# EasyEDA Pro project ProPrj_DSP BOARD_2026-03-01.epro, schematic Schematic1
Page Name: P1; Project Name: Project Name; Schematic Name: Schematic Name; Update Date: 2021.11.05; Company: EasyEDA.com; Drawn: SUGEX; Page Size: A4; Version: V1.0
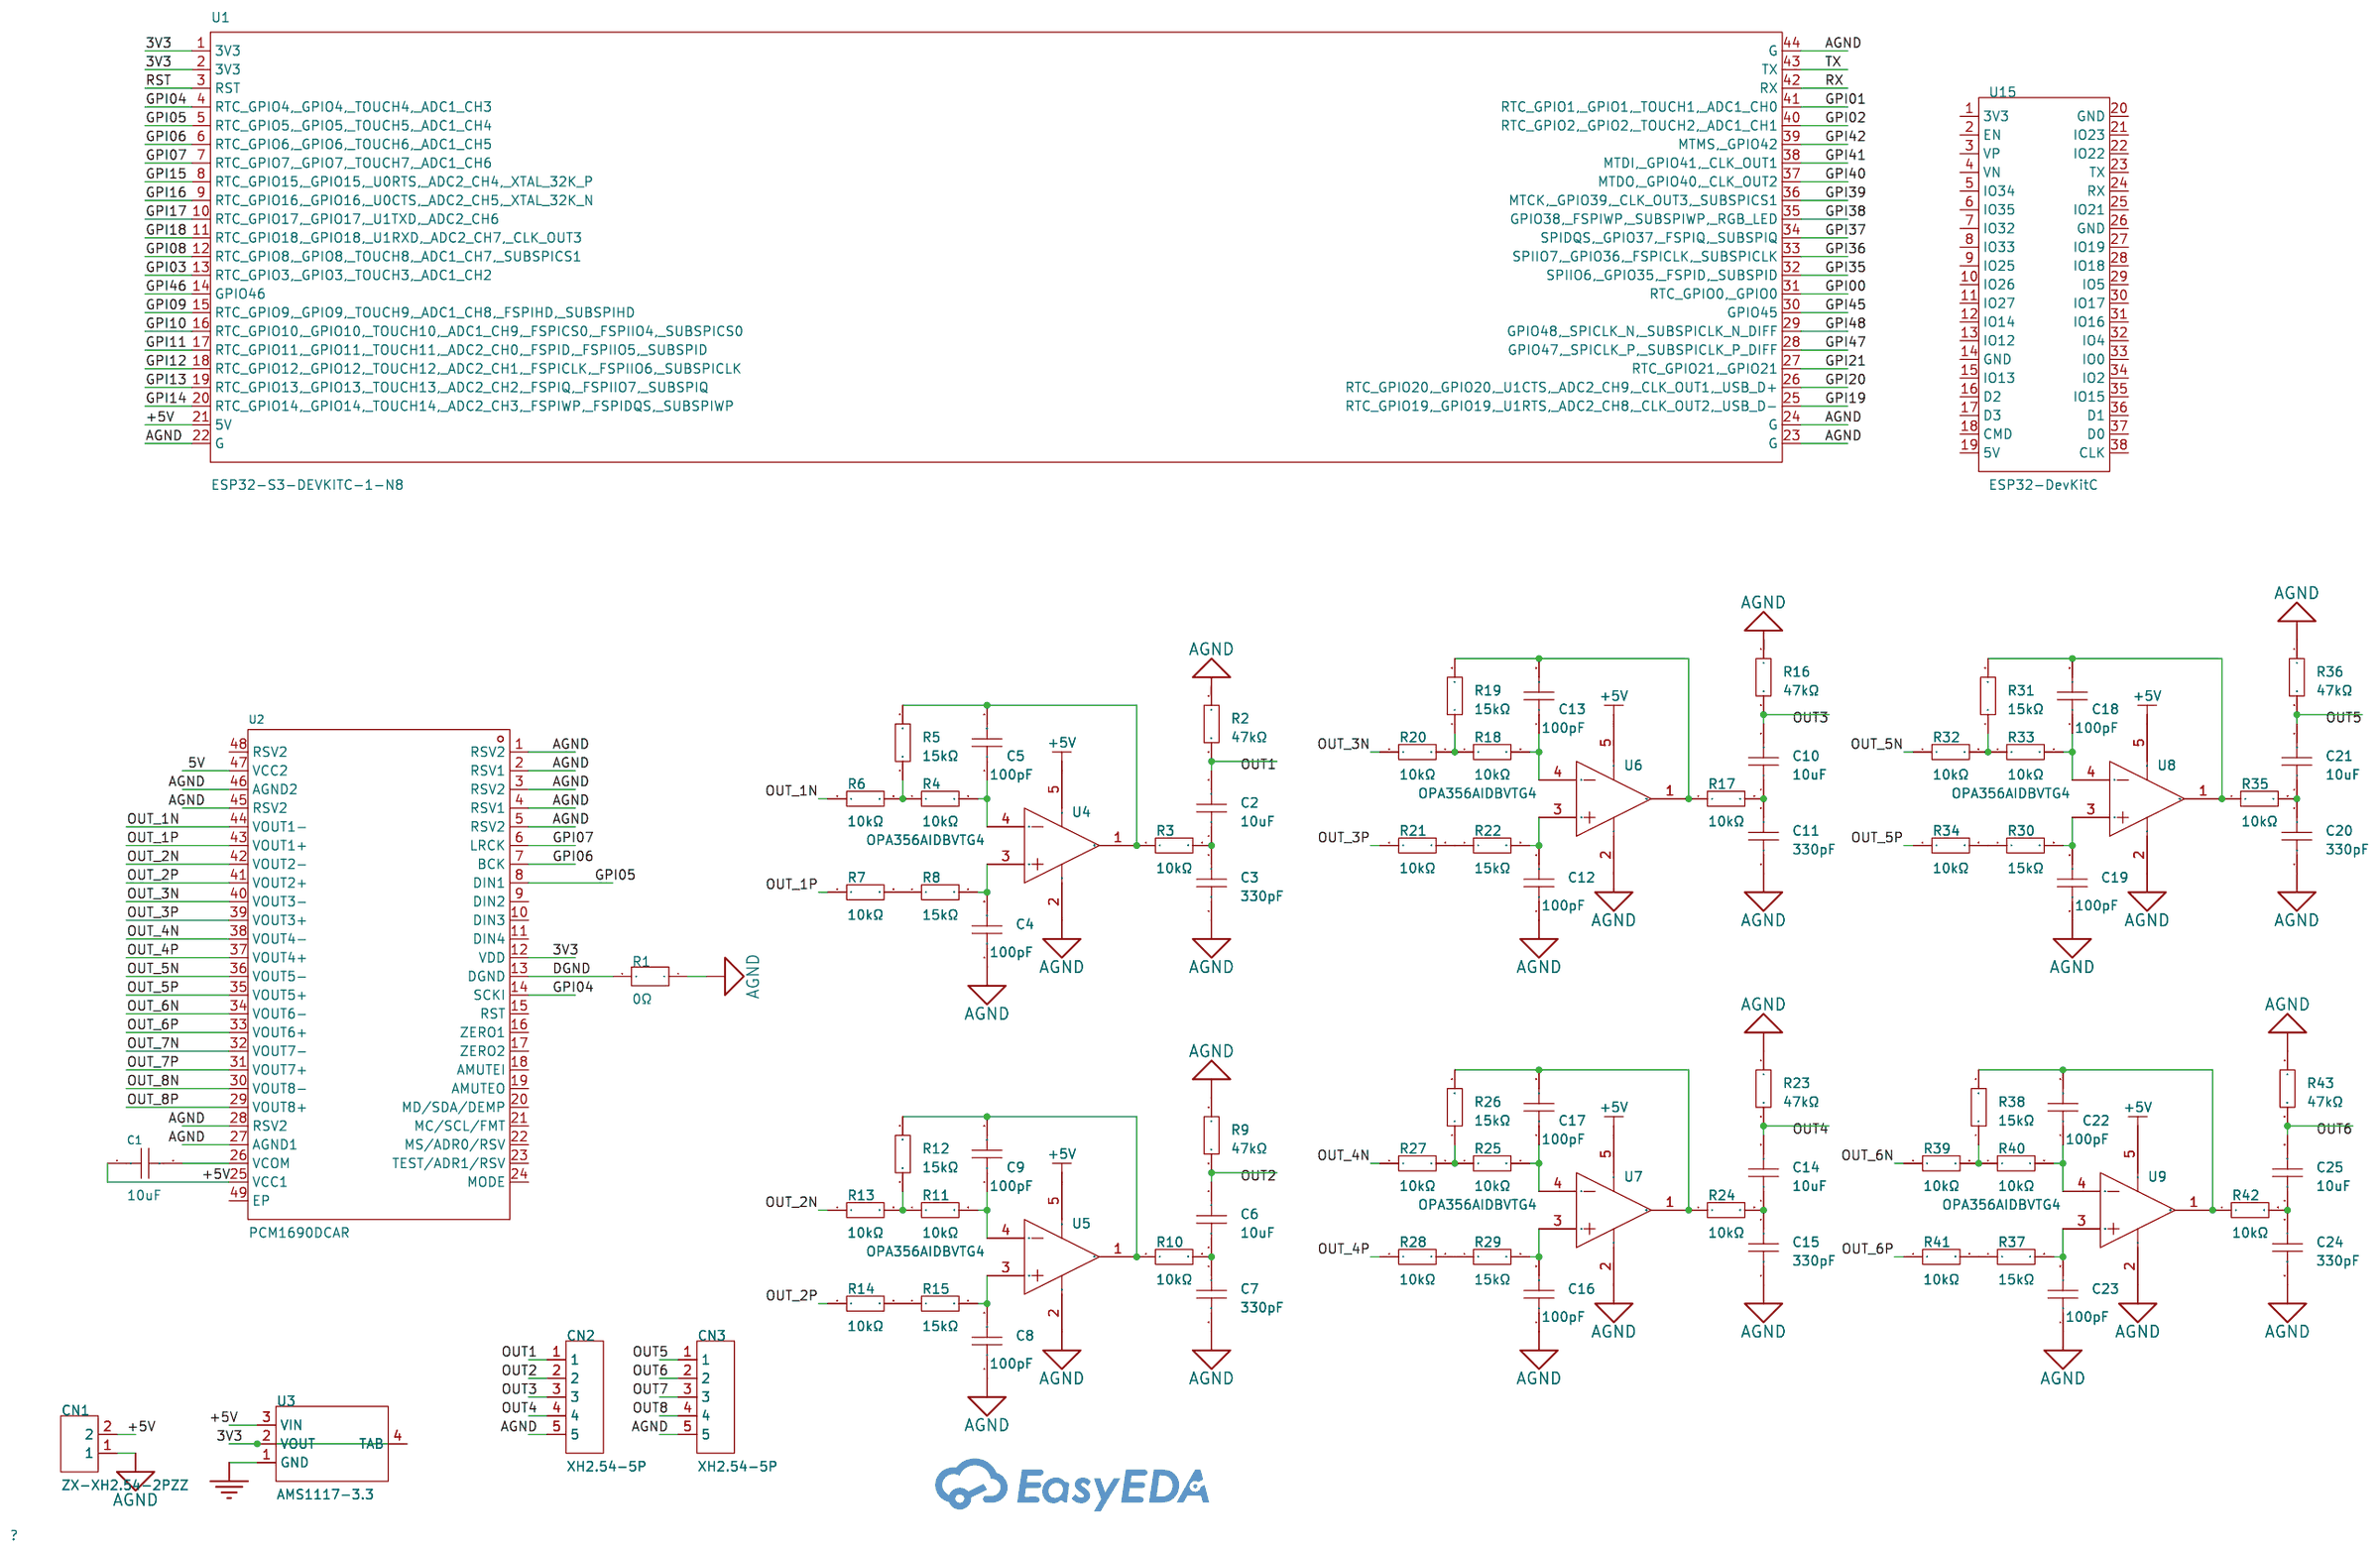
[diagram p0: schematic sheet]

## Parts
C1  10uF  [C0603]
C2  10uF  [C0603]
C3  330pF  [C0603]
C4  100pF  [C0603]
C5  100pF  [C0603]
C6  10uF  [C0603]
C7  330pF  [C0603]
C8  100pF  [C0603]
C9  100pF  [C0603]
C10  10uF  [C0603]
C11  330pF  [C0603]
C12  100pF  [C0603]
C13  100pF  [C0603]
C14  10uF  [C0603]
C15  330pF  [C0603]
C16  100pF  [C0603]
C17  100pF  [C0603]
C18  100pF  [C0603]
C19  100pF  [C0603]
C20  330pF  [C0603]
C21  10uF  [C0603]
C22  100pF  [C0603]
C23  100pF  [C0603]
C24  330pF  [C0603]
C25  10uF  [C0603]
CN1  ZX-XH2.54-2PZZ  [CONN-TH_2P-P2.50_HX25003-2A]  (no BOM)
CN2  XH2.54-5P  [CONN-TH_5P-P2.54_C9900008095]  (no BOM)
CN3  XH2.54-5P  [CONN-TH_5P-P2.54_C9900008095]  (no BOM)
R1  0Ω  [R0402]
R2  47kΩ  [R0603]
R3  10kΩ  [R0603]
R4  10kΩ  [R0603]
R5  15kΩ  [R0603]
R6  10kΩ  [R0603]
R7  10kΩ  [R0603]
R8  15kΩ  [R0603]
R9  47kΩ  [R0603]
R10  10kΩ  [R0603]
R11  10kΩ  [R0603]
R12  15kΩ  [R0603]
R13  10kΩ  [R0603]
R14  10kΩ  [R0603]
R15  15kΩ  [R0603]
R16  47kΩ  [R0603]
R17  10kΩ  [R0603]
R18  10kΩ  [R0603]
R19  15kΩ  [R0603]
R20  10kΩ  [R0603]
R21  10kΩ  [R0603]
R22  15kΩ  [R0603]
R23  47kΩ  [R0603]
R24  10kΩ  [R0603]
R25  10kΩ  [R0603]
R26  15kΩ  [R0603]
R27  10kΩ  [R0603]
R28  10kΩ  [R0603]
R29  15kΩ  [R0603]
R30  15kΩ  [R0603]
R31  15kΩ  [R0603]
R32  10kΩ  [R0603]
R33  10kΩ  [R0603]
R34  10kΩ  [R0603]
R35  10kΩ  [R0603]
R36  47kΩ  [R0603]
R37  15kΩ  [R0603]
R38  15kΩ  [R0603]
R39  10kΩ  [R0603]
R40  10kΩ  [R0603]
R41  10kΩ  [R0603]
R42  10kΩ  [R0603]
R43  47kΩ  [R0603]
U1  ESP32-S3-DEVKITC-1-N8  [CONN-TH_ESP32-S3-DEVKITC-1U-N8]  (no BOM)
U2  PCM1690DCAR  [HTSSOP-48_L12.5-W6.1-P0.50-LS8.1-BL-EP-1]
U3  AMS1117-3.3  [SOT-223-3_L6.5-W3.5-P3.05-LS7.0]
U4  OPA356AIDBVTG4  [SOT-23-5_L3.0-W1.5-P0.95-LS2.8-BL]
U5  OPA356AIDBVTG4  [SOT-23-5_L3.0-W1.5-P0.95-LS2.8-BL]
U6  OPA356AIDBVTG4  [SOT-23-5_L3.0-W1.5-P0.95-LS2.8-BL]
U7  OPA356AIDBVTG4  [SOT-23-5_L3.0-W1.5-P0.95-LS2.8-BL]
U8  OPA356AIDBVTG4  [SOT-23-5_L3.0-W1.5-P0.95-LS2.8-BL]
U9  OPA356AIDBVTG4  [SOT-23-5_L3.0-W1.5-P0.95-LS2.8-BL]
U15  ESP32-DevKitC  [BULETM-SMD_ESP32-DEVKITC]  (no BOM)

## Library data of the parts
C1 = CL10A106MA8NRNC: Capacitance:10uF Tolerance:±20% Tolerance:±20% Voltage Rating:25V Temperature Coefficient:X5R; LCSC Part Name: 10uF ±20% 25V; Supplier Part: C96446; Manufacturer: SAMSUNG(三星); Supplier Footprint: 0603; JLCPCB Part Class: Basic Part; Datasheet: https://item.szlcsc.com/datasheet/CL10A106MA8NRNC/97651.html; Supplier: LCSC; Tolerance: ±20%; Voltage Rating: 25V; Temperature Coefficient: X5R
C2-C25 = CAP_0603: Supplier Footprint: 0603
CN1 = ZX-XH2.54-2PZZ: Pins Structure:1x2P Pitch:2.5mm Mounting Type:Through Hole Reference Series:XH Number of Pins:2P Number of Rows:1 Number of PINs Per Row:2 Row Spacing:- Current Rating:2A Contact Material:Brass Contact Plating:Tin Operating Temperature:-25℃~+85℃ Operating; LCSC Part Name: 1x2P 间距:2.5mm 直插 系列:XH; Supplier Part: C7429632; Manufacturer: Megastar(兆星); Supplier Footprint: 插件,P=2.5mm; JLCPCB Part Class: Extended Part; Datasheet: https://item.szlcsc.com/datasheet/ZX-XH2.54-2PZZ/8427549.html; Supplier: LCSC; Pins Structure: 1x2P; Pitch: 2.5mm; Mounting Type: Through Hole; Reference Series: XH; Number of Pins: 2P; Number of Rows: 1; Number of PINs Per Row: 2; Current Rating: 2A; Contact Material: Brass; Contact Plating: Tin; Operating Temperature: -25℃~+85℃; Voltage Rating: 250V; Plastic Material: PA66; Flame Retardant Rating: UL94V-0; Color: White; Z-Height of the Board: 7mm; X-Length of Bottom Edge on Board (Spacing Line): 7.5mm; Y-Width of Bottom Edge on Board: 5.9mm
CN2 CN3 = XH2.54-5P: Supplier Part: C9900017328; JLCPCB Part Class: Extended Part; Supplier: LCSC
R1 = FRC0402P000 TS: Type:Thick Film Resistor Resistance:0Ω Tolerance:±5% Tolerance:±5% Power(Watts):62.5mW Voltage-Supply(Max):50V Operating Temperature:-55℃~+155℃ Operating Temperature:-55℃~+155℃; LCSC Part Name: 0Ω ±5% 62.5mW 厚膜电阻; Supplier Part: C2906877; Manufacturer: FOJAN(富捷); Supplier Footprint: 0402; JLCPCB Part Class: Extended Part; Supplier: LCSC; Type: Thick Film Resistor; Tolerance: ±5%; Power(Watts): 62.5mW; Voltage-Supply(Max): 50V; Operating Temperature: -55℃~+155℃
R2 R9 R16 R23 R36 R43 = FRC0603F4702TS: Type:Thick Film Resistor Resistance:47kΩ Tolerance:±1% Tolerance:±1% Power(Watts):100mW Voltage-Supply(Max):75V Temperature Coefficient:±100ppm/℃ Temperature Coefficient:±100ppm/℃ Operating Temperature:-55℃~+155℃ Operating Temperature:-55℃~+155℃; LCSC Part Name: 47kΩ ±1% 100mW 厚膜电阻; Supplier Part: C2907042; Manufacturer: FOJAN(富捷); Supplier Footprint: 0603; JLCPCB Part Class: Extended Part; Supplier: LCSC; Type: Thick Film Resistor; Tolerance: ±1%; Power(Watts): 100mW; Voltage-Supply(Max): 75V; Temperature Coefficient: ±100ppm/℃; Operating Temperature: -55℃~+155℃
R3 R4 R6 R7 R10 R11 R13 R14 R17 R18 R20 R21 R24 R25 R27 R28 R32-R35 R39-R42 = FRC0603F1002TS: Type:Thick Film Resistor Resistance:10kΩ Tolerance:±1% Tolerance:±1% Power(Watts):100mW Voltage-Supply(Max):75V Temperature Coefficient:±100ppm/℃ Temperature Coefficient:±100ppm/℃ Operating Temperature:-55℃~+155℃ Operating Temperature:-55℃~+155℃; LCSC Part Name: 10kΩ ±1% 100mW 厚膜电阻; Supplier Part: C2906982; Manufacturer: FOJAN(富捷); Supplier Footprint: 0603; JLCPCB Part Class: Extended Part; Supplier: LCSC; Type: Thick Film Resistor; Tolerance: ±1%; Power(Watts): 100mW; Voltage-Supply(Max): 75V; Temperature Coefficient: ±100ppm/℃; Operating Temperature: -55℃~+155℃
R5 R8 R12 R15 R19 R22 R26 R29-R31 R37 R38 = FRC0603F1502TS: Type:Thick Film Resistor Resistance:15kΩ Tolerance:±1% Tolerance:±1% Power(Watts):100mW Voltage-Supply(Max):75V Temperature Coefficient:±100ppm/℃ Temperature Coefficient:±100ppm/℃ Operating Temperature:-55℃~+155℃ Operating Temperature:-55℃~+155℃; LCSC Part Name: 15kΩ ±1% 100mW 厚膜电阻; Supplier Part: C2906995; Manufacturer: FOJAN(富捷); Supplier Footprint: 0603; JLCPCB Part Class: Extended Part; Supplier: LCSC; Type: Thick Film Resistor; Tolerance: ±1%; Power(Watts): 100mW; Voltage-Supply(Max): 75V; Temperature Coefficient: ±100ppm/℃; Operating Temperature: -55℃~+155℃
U1 = ESP32-S3-DEVKITC-1-N8: Supplier Part: C20438410; Manufacturer: ESPRESSIF(乐鑫); JLCPCB Part Class: Extended Part; Supplier: LCSC
U2 = PCM1690DCAR: Resolution(Bits):24 Number of Channels:8 Interface:I2C Voltage - Supply:4.5V~5.5V Voltage - Supply:4.5V~5.5V Settling Time:- Output Type:- Integral non - linearity:- Integral non - linearity:- Operating Temperature:-40℃~+85℃ Operating Temperature:-40℃~+85; LCSC Part Name: 24位、192kHz采样、增强多级△E八通道音频数模转换器; Supplier Part: C181276; Manufacturer: TI(德州仪器); Supplier Footprint: HTSSOP-48-EP-6.1mm; JLCPCB Part Class: Extended Part; Datasheet: https://www.ti.com/cn/lit/gpn/pcm1690; Supplier: LCSC; Resolution(Bits): 24; Number of Channels: 8; Interface: I2C; Voltage - Supply: 4.5V~5.5V; Operating Temperature: -40℃~+85℃; Sampling Rate: 192kHz; Quiescent Current (Iq): 170uA
U3 = AMS1117-3.3_C5250992: Output Type:Fixed Voltage - Supply:12V Output Voltage:3.3V Output Voltage:3.3V Output Current:1A Power Supply Rejection Ratio (PSRR):70dB@(120Hz) Voltage Dropout:1.4V@(1A) standby current:3mA Noise:0.003%Vout Features:Over Temperature Protection Operating; LCSC Part Name: 3.3V 1A 12V; Supplier Part: C5250992; Manufacturer: TWGMC(迪嘉); Supplier Footprint: SOT-223-3L; JLCPCB Part Class: Extended Part; Datasheet: https://item.szlcsc.com/datasheet/AMS1117-3.3/5967328.html; Supplier: LCSC; Output Type: Fixed; Voltage - Supply: 12V; Output Voltage: 3.3V; Output Current: 1A; Power Supply Rejection Ratio (PSRR): 70dB@(120Hz); Voltage Dropout: 1.4V@(1A); standby current: 3mA; Noise: 0.003%Vout; Features: Over Temperature Protection; Operating Temperature: -40℃~+125℃@(Tj); Output Configuration: Positive; Number of Outputs: 1
U4-U9 = OPA356AIDBVTG4: Supplier Part: C21273264; Manufacturer: TI(德州仪器); Supplier: LCSC
U15 = ESP32-DevKitC: CPU:- ROM Size:- Number of I/O: USB:- WIFI Protocols:- Bluetooth:- Ethernet:- Audio & Video Interface:- Multimedia Support:- Card Type:- Power Supply Type:- Power Supply:- POE Support:- Resolution:- Temperature Range:-; LCSC Part Name: 开发板; Supplier Part: C571180; Manufacturer: ESPRESSIF(乐鑫); JLCPCB Part Class: Extended Part; Datasheet: https://atta.szlcsc.com/upload/public/pdf/source/20200521/C529586_D6FCDAFCFF160B3EDDF7DF28D600699D.pdf; Supplier: LCSC

## Nets
3V3: U1.1(3V3) U1.2(3V3) U2.12(VDD) U3.2(VOUT) U3.4(TAB)
5V: U2.47(VCC2)
+5V: C1.1 CN1.2 U1.21(5V) U2.25(VCC1) U3.3(VIN) U4.5(V+) U5.5(V+) U6.5(V+) U7.5(V+) U8.5(V+) U9.5(V+)
AGND: C3.2 C4.1 C7.2 C8.1 C11.2 C12.1 C15.2 C16.1 C19.1 C20.2 C23.1 C24.2 CN1.1 CN2.5 CN3.5 R1.1 R2.1 R9.1 R16.1 R23.1 R36.1 R43.1 U1.22(G) U1.23(G) U1.24(G) U1.44(G) U2.1(RSV2) U2.2(RSV1) U2.3(RSV2) U2.4(RSV1) U2.5(RSV2) U2.27(AGND1) U2.28(RSV2) U2.45(RSV2) U2.46(AGND2) U4.2(V-) U5.2(V-) U6.2(V-) U7.2(V-) U8.2(V-) U9.2(V-)
DGND: R1.2 U2.13(DGND) U3.1(GND)
GPI00: U1.31(RTC_GPIO0, GPIO0)
GPI01: U1.41(RTC_GPIO1, GPIO1, TOUCH1, ADC1_CH0)
GPI02: U1.40(RTC_GPIO2, GPIO2, TOUCH2, ADC1_CH1)
GPI03: U1.13(RTC_GPIO3, GPIO3, TOUCH3, ADC1_CH2)
GPI04: U1.4(RTC_GPIO4, GPIO4, TOUCH4, ADC1_CH3) U2.14(SCKI)
GPI05: U1.5(RTC_GPIO5, GPIO5, TOUCH5, ADC1_CH4) U2.8(DIN1)
GPI06: U1.6(RTC_GPIO6, GPIO6, TOUCH6, ADC1_CH5) U2.7(BCK)
GPI07: U1.7(RTC_GPIO7, GPIO7, TOUCH7, ADC1_CH6) U2.6(LRCK)
GPI08: U1.12(RTC_GPIO8, GPIO8, TOUCH8, ADC1_CH7, SUBSPICS1)
GPI09: U1.15(RTC_GPIO9, GPIO9, TOUCH9, ADC1_CH8, FSPIHD, SUBSPIHD)
GPI10: U1.16(RTC_GPIO10, GPIO10, TOUCH10, ADC1_CH9, FSPICS0, FSPIIO4, SUBSPICS0)
GPI11: U1.17(RTC_GPIO11, GPIO11, TOUCH11, ADC2_CH0, FSPID, FSPIIO5, SUBSPID)
GPI12: U1.18(RTC_GPIO12, GPIO12, TOUCH12, ADC2_CH1, FSPICLK, FSPIIO6, SUBSPICLK)
GPI13: U1.19(RTC_GPIO13, GPIO13, TOUCH13, ADC2_CH2, FSPIQ, FSPIIO7, SUBSPIQ)
GPI14: U1.20(RTC_GPIO14, GPIO14, TOUCH14, ADC2_CH3, FSPIWP, FSPIDQS, SUBSPIWP)
GPI15: U1.8(RTC_GPIO15, GPIO15, U0RTS, ADC2_CH4, XTAL_32K_P)
GPI16: U1.9(RTC_GPIO16, GPIO16, U0CTS, ADC2_CH5, XTAL_32K_N)
GPI17: U1.10(RTC_GPIO17, GPIO17, U1TXD, ADC2_CH6)
GPI18: U1.11(RTC_GPIO18, GPIO18, U1RXD, ADC2_CH7, CLK_OUT3)
GPI19: U1.25(RTC_GPIO19, GPIO19, U1RTS, ADC2_CH8, CLK_OUT2, USB_D-)
GPI20: U1.26(RTC_GPIO20, GPIO20, U1CTS, ADC2_CH9, CLK_OUT1, USB_D+)
GPI21: U1.27(RTC_GPIO21, GPIO21)
GPI35: U1.32(SPIIO6, GPIO35, FSPID, SUBSPID)
GPI36: U1.33(SPIIO7, GPIO36, FSPICLK, SUBSPICLK)
GPI37: U1.34(SPIDQS, GPIO37, FSPIQ, SUBSPIQ)
GPI38: U1.35(GPIO38, FSPIWP, SUBSPIWP, RGB LED)
GPI39: U1.36(MTCK, GPIO39, CLK_OUT3, SUBSPICS1)
GPI40: U1.37(MTDO, GPIO40, CLK_OUT2)
GPI41: U1.38(MTDI, GPIO41, CLK_OUT1)
GPI42: U1.39(MTMS, GPIO42)
GPI45: U1.30(GPIO45)
GPI46: U1.14(GPIO46)
GPI47: U1.28(GPIO47, SPICLK_P, SUBSPICLK_P_DIFF)
GPI48: U1.29(GPIO48, SPICLK_N, SUBSPICLK_N_DIFF)
OUT1: C2.2 CN2.1 R2.2
OUT2: C6.2 CN2.2 R9.2
OUT3: C10.2 CN2.3 R16.2
OUT4: C14.2 CN2.4 R23.2
OUT5: C21.2 CN3.1 R36.2
OUT6: C25.2 CN3.2 R43.2
OUT7: CN3.3
OUT8: CN3.4
OUT_1N: R6.1 U2.44(VOUT1-)
OUT_1P: R7.1 U2.43(VOUT1+)
OUT_2N: R13.1 U2.42(VOUT2-)
OUT_2P: R14.1 U2.41(VOUT2+)
OUT_3N: R20.1 U2.40(VOUT3-)
OUT_3P: R21.1 U2.39(VOUT3+)
OUT_4N: R27.1 U2.38(VOUT4-)
OUT_4P: R28.1 U2.37(VOUT4+)
OUT_5N: R32.1 U2.36(VOUT5-)
OUT_5P: R34.1 U2.35(VOUT5+)
OUT_6N: R39.1 U2.34(VOUT6-)
OUT_6P: R41.1 U2.33(VOUT6+)
OUT_7N: U2.32(VOUT7-)
OUT_7P: U2.31(VOUT7+)
OUT_8N: U2.30(VOUT8-)
OUT_8P: U2.29(VOUT8+)
RST: U1.3(RST)
RX: U1.42(RX)
TX: U1.43(TX)
$1N5043: C1.2 U2.26(VCOM)
$1N12831: C5.1 R4.2 U4.4(IN -)
$1N12836: R4.1 R5.1 R6.2
$1N12844: R7.2 R8.1
$1N12849: C4.2 R8.2 U4.3(IN +)
$1N12960: C5.2 R3.1 R5.2 U4.1(OUT)
$1N13165: C2.1 C3.1 R3.2
$1N14184: C9.1 R11.2 U5.4(IN -)
$1N14188: R11.1 R12.1 R13.2
$1N14195: C8.2 R15.2 U5.3(IN +)
$1N14202: C6.1 C7.1 R10.2
$1N14213: R14.2 R15.1
$1N14217: C9.2 R10.1 R12.2 U5.1(OUT)
$1N20006: R25.1 R26.1 R27.2
$1N20009: C16.2 R29.2 U7.3(IN +)
$1N20011: C17.1 R25.2 U7.4(IN -)
$1N20014: R28.2 R29.1
$1N20015: C17.2 R24.1 R26.2 U7.1(OUT)
$1N20016: C13.2 R17.1 R19.2 U6.1(OUT)
$1N20019: C10.1 C11.1 R17.2
$1N20024: C14.1 C15.1 R24.2
$1N20031: C12.2 R22.2 U6.3(IN +)
$1N20032: R21.2 R22.1
$1N20035: R18.1 R19.1 R20.2
$1N20036: C13.1 R18.2 U6.4(IN -)
$1N26516: C20.1 C21.1 R35.2
$1N26519: C19.2 R30.2 U8.3(IN +)
$1N26520: R30.1 R34.2
$1N26521: R31.1 R32.2 R33.1
$1N26522: C18.2 R31.2 R35.1 U8.1(OUT)
$1N26524: C18.1 R33.2 U8.4(IN -)
$1N26990: C24.1 C25.1 R42.2
$1N26993: C23.2 R37.2 U9.3(IN +)
$1N26994: R37.1 R41.2
$1N26995: R38.1 R39.2 R40.1
$1N26996: C22.2 R38.2 R42.1 U9.1(OUT)
$1N26998: C22.1 R40.2 U9.4(IN -)

Not connected (* = marked no-connect by the designer): U2 9(DIN2) 10(DIN3) 11(DIN4) 15(RST) 16(ZERO1) 17(ZERO2) 18(AMUTEI) 19(AMUTEO) 20(MD/SDA/DEMP) 21(MC/SCL/FMT) 22(MS/ADR0/RSV) 23(TEST/ADR1/RSV) 24(MODE) 48(RSV2) 49(EP); U15 1(3V3) 2(EN) 3(VP) 4(VN) 5(IO34) 6(IO35) 7(IO32) 8(IO33) 9(IO25) 10(IO26) 11(IO27) 12(IO14) 13(IO12) 14(GND) 15(IO13) 16(D2) 17(D3) 18(CMD) 19(5V) 20(GND) 21(IO23) 22(IO22) 23(TX) 24(RX) 25(IO21) 26(GND) 27(IO19) 28(IO18) 29(IO5) 30(IO17) 31(IO16) 32(IO4) 33(IO0) 34(IO2) 35(IO15) 36(D1) 37(D0) 38(CLK)
